# Altium schematic sheet Measuring.SchDoc: Voltage Measurer
size 420 x 297 mm; ENG_APP_DATE: --/--/--; DSN_APP_DATE: --/--/--; CHK_APP_DATE: --/--/--; Revision: Cell Balancing
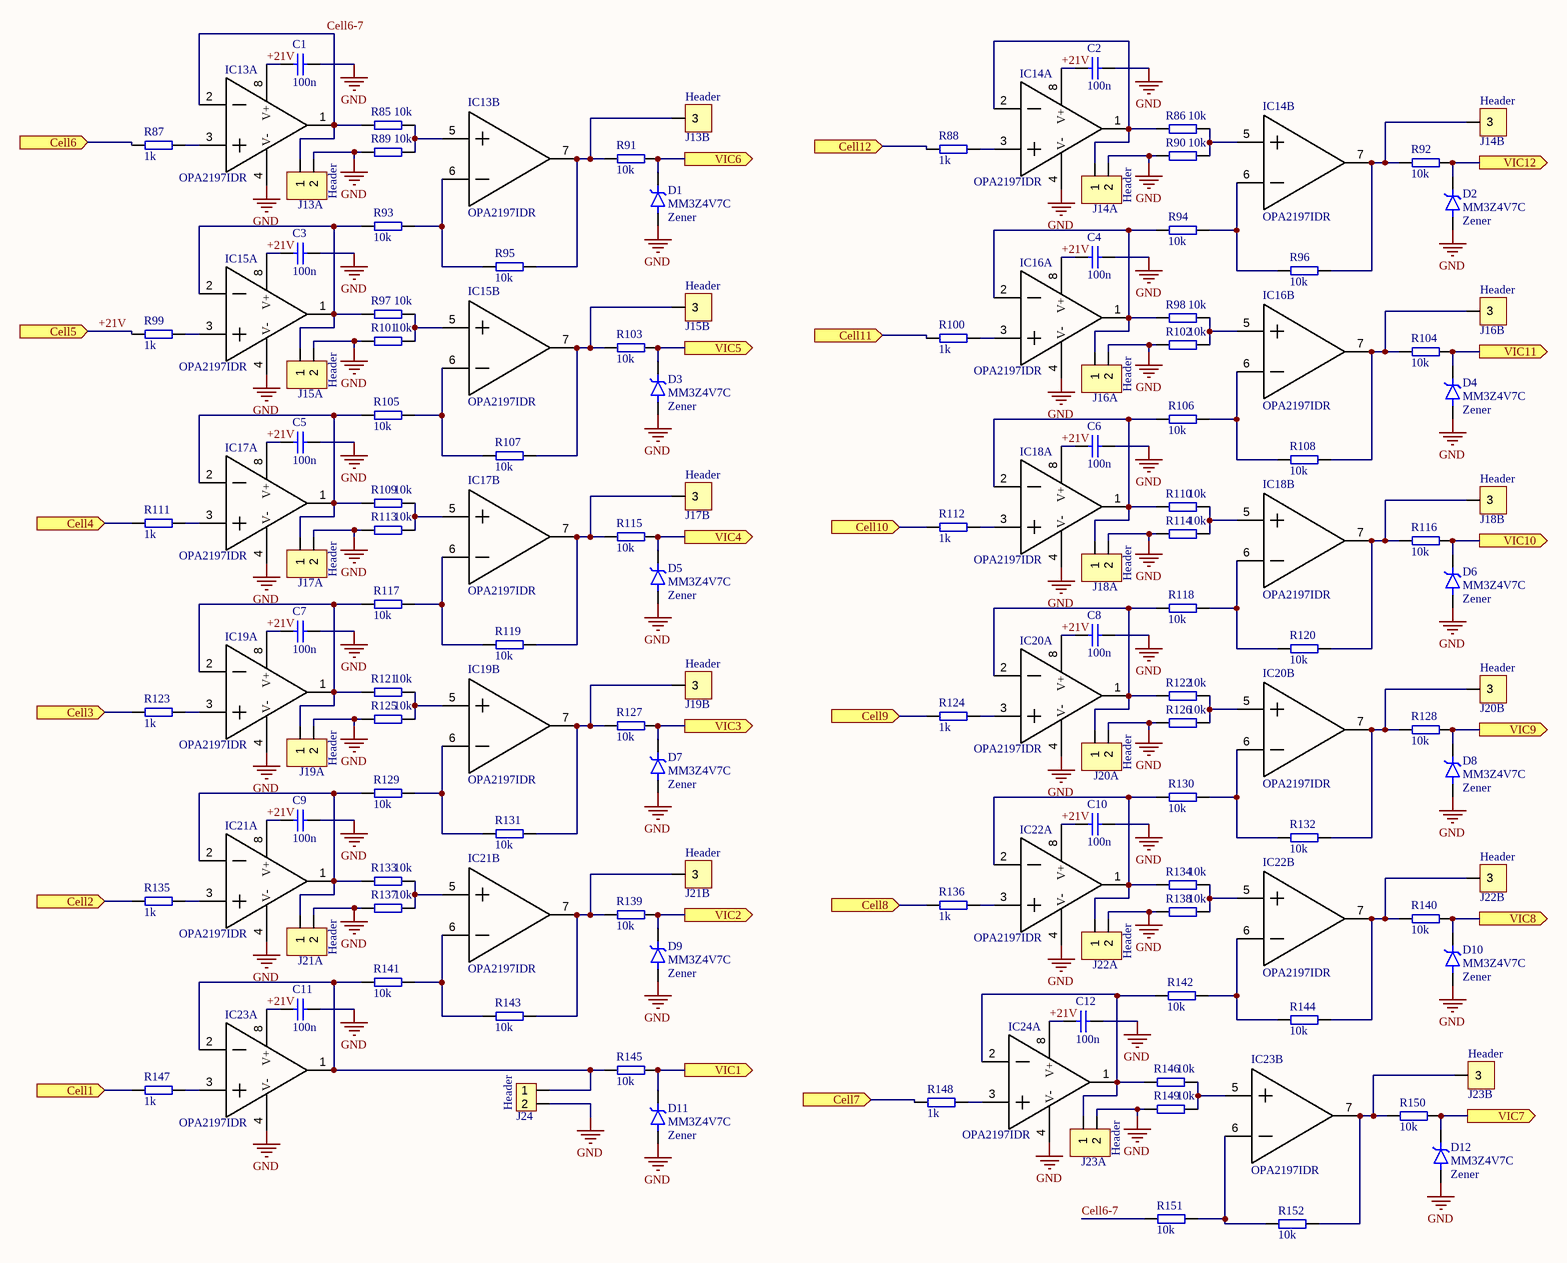
[diagram p0: Measuring.SchDoc]

## Parts
C1  Name: 100n  [C_0805]  (hidden comment: 100nF_35V)
C2  Name: 100n  [C_0805]  (hidden comment: 100nF_35V)
C3  Name: 100n  [C_0805]  (hidden comment: 100nF_35V)
C4  Name: 100n  [C_0805]  (hidden comment: 100nF_35V)
C5  Name: 100n  [C_0805]  (hidden comment: 100nF_35V)
C6  Name: 100n  [C_0805]  (hidden comment: 100nF_35V)
C7  Name: 100n  [C_0805]  (hidden comment: 100nF_35V)
C8  Name: 100n  [C_0805]  (hidden comment: 100nF_35V)
C9  Name: 100n  [C_0805]  (hidden comment: 100nF_35V)
C10  Name: 100n  [C_0805]  (hidden comment: 100nF_35V)
C11  Name: 100n  [C_0805]  (hidden comment: 100nF_35V)
C12  Name: 100n  [C_0805]  (hidden comment: 100nF_35V)
D1  value MM3Z4V7C  Type: Zener  [SODFL2512X90N]  (hidden comment: MM3Z4V7C_SOD-323F)
D2  value MM3Z4V7C  Type: Zener  [SODFL2512X90N]  (hidden comment: MM3Z4V7C_SOD-323F)
D3  value MM3Z4V7C  Type: Zener  [SODFL2512X90N]  (hidden comment: MM3Z4V7C_SOD-323F)
D4  value MM3Z4V7C  Type: Zener  [SODFL2512X90N]  (hidden comment: MM3Z4V7C_SOD-323F)
D5  value MM3Z4V7C  Type: Zener  [SODFL2512X90N]  (hidden comment: MM3Z4V7C_SOD-323F)
D6  value MM3Z4V7C  Type: Zener  [SODFL2512X90N]  (hidden comment: MM3Z4V7C_SOD-323F)
D7  value MM3Z4V7C  Type: Zener  [SODFL2512X90N]  (hidden comment: MM3Z4V7C_SOD-323F)
D8  value MM3Z4V7C  Type: Zener  [SODFL2512X90N]  (hidden comment: MM3Z4V7C_SOD-323F)
D9  value MM3Z4V7C  Type: Zener  [SODFL2512X90N]  (hidden comment: MM3Z4V7C_SOD-323F)
D10  value MM3Z4V7C  Type: Zener  [SODFL2512X90N]  (hidden comment: MM3Z4V7C_SOD-323F)
D11  value MM3Z4V7C  Type: Zener  [SODFL2512X90N]  (hidden comment: MM3Z4V7C_SOD-323F)
D12  value MM3Z4V7C  Type: Zener  [SODFL2512X90N]  (hidden comment: MM3Z4V7C_SOD-323F)
IC13  Manufacturer_Part_Number: OPA2197IDR  [SOIC8]  (hidden comment: OPA2197IDR_8-SOIC)  (parts A,B of 2)
IC14  Manufacturer_Part_Number: OPA2197IDR  [SOIC8]  (hidden comment: OPA2197IDR_8-SOIC)  (parts A,B of 2)
IC15  Manufacturer_Part_Number: OPA2197IDR  [SOIC8]  (hidden comment: OPA2197IDR_8-SOIC)  (parts A,B of 2)
IC16  Manufacturer_Part_Number: OPA2197IDR  [SOIC8]  (hidden comment: OPA2197IDR_8-SOIC)  (parts A,B of 2)
IC17  Manufacturer_Part_Number: OPA2197IDR  [SOIC8]  (hidden comment: OPA2197IDR_8-SOIC)  (parts A,B of 2)
IC18  Manufacturer_Part_Number: OPA2197IDR  [SOIC8]  (hidden comment: OPA2197IDR_8-SOIC)  (parts A,B of 2)
IC19  Manufacturer_Part_Number: OPA2197IDR  [SOIC8]  (hidden comment: OPA2197IDR_8-SOIC)  (parts A,B of 2)
IC20  Manufacturer_Part_Number: OPA2197IDR  [SOIC8]  (hidden comment: OPA2197IDR_8-SOIC)  (parts A,B of 2)
IC21  Manufacturer_Part_Number: OPA2197IDR  [SOIC8]  (hidden comment: OPA2197IDR_8-SOIC)  (parts A,B of 2)
IC22  Manufacturer_Part_Number: OPA2197IDR  [SOIC8]  (hidden comment: OPA2197IDR_8-SOIC)  (parts A,B of 2)
IC23  Manufacturer_Part_Number: OPA2197IDR  [SOIC8]  (hidden comment: OPA2197IDR_8-SOIC)  (parts A,B of 2)
IC24  Manufacturer_Part_Number: OPA2197IDR  [SOIC8]  (hidden comment: OPA2197IDR_8-SOIC)  (part A of 2)
J13  Name: Header  [HDR_1X3_2.54mm-MALE]  (hidden comment: 2.54mm pitch)  (parts A,B of 2)
J14  Name: Header  [HDR_1X3_2.54mm-MALE]  (hidden comment: 2.54mm pitch)  (parts A,B of 2)
J15  Name: Header  [HDR_1X3_2.54mm-MALE]  (hidden comment: 2.54mm pitch)  (parts A,B of 2)
J16  Name: Header  [HDR_1X3_2.54mm-MALE]  (hidden comment: 2.54mm pitch)  (parts A,B of 2)
J17  Name: Header  [HDR_1X3_2.54mm-MALE]  (hidden comment: 2.54mm pitch)  (parts A,B of 2)
J18  Name: Header  [HDR_1X3_2.54mm-MALE]  (hidden comment: 2.54mm pitch)  (parts A,B of 2)
J19  Name: Header  [HDR_1X3_2.54mm-MALE]  (hidden comment: 2.54mm pitch)  (parts A,B of 2)
J20  Name: Header  [HDR_1X3_2.54mm-MALE]  (hidden comment: 2.54mm pitch)  (parts A,B of 2)
J21  Name: Header  [HDR_1X3_2.54mm-MALE]  (hidden comment: 2.54mm pitch)  (parts A,B of 2)
J22  Name: Header  [HDR_1X3_2.54mm-MALE]  (hidden comment: 2.54mm pitch)  (parts A,B of 2)
J23  Name: Header  [HDR_1X3_2.54mm-MALE]  (hidden comment: 2.54mm pitch)  (parts A,B of 2)
J24  Name: Header  [HDR_1x2_2.54mm-MALE]  (hidden comment: 2.54mm pitch)
R85  Name: 10k  [R_0805]  (hidden comment: 10k_125mW)
R86  Name: 10k  [R_0805]  (hidden comment: 10k_125mW)
R87  Name: 1k  [R_0805]  (hidden comment: 1k_125mW)
R88  Name: 1k  [R_0805]  (hidden comment: 1k_125mW)
R89  Name: 10k  [R_0805]  (hidden comment: 10k_125mW)
R90  Name: 10k  [R_0805]  (hidden comment: 10k_125mW)
R91  Name: 10k  [R_0805]  (hidden comment: 10k_125mW)
R92  Name: 10k  [R_0805]  (hidden comment: 10k_125mW)
R93  Name: 10k  [R_0805]  (hidden comment: 10k_125mW)
R94  Name: 10k  [R_0805]  (hidden comment: 10k_125mW)
R95  Name: 10k  [R_0805]  (hidden comment: 10k_125mW)
R96  Name: 10k  [R_0805]  (hidden comment: 10k_125mW)
R97  Name: 10k  [R_0805]  (hidden comment: 10k_125mW)
R98  Name: 10k  [R_0805]  (hidden comment: 10k_125mW)
R99  Name: 1k  [R_0805]  (hidden comment: 1k_125mW)
R100  Name: 1k  [R_0805]  (hidden comment: 1k_125mW)
R101  Name: 10k  [R_0805]  (hidden comment: 10k_125mW)
R102  Name: 10k  [R_0805]  (hidden comment: 10k_125mW)
R103  Name: 10k  [R_0805]  (hidden comment: 10k_125mW)
R104  Name: 10k  [R_0805]  (hidden comment: 10k_125mW)
R105  Name: 10k  [R_0805]  (hidden comment: 10k_125mW)
R106  Name: 10k  [R_0805]  (hidden comment: 10k_125mW)
R107  Name: 10k  [R_0805]  (hidden comment: 10k_125mW)
R108  Name: 10k  [R_0805]  (hidden comment: 10k_125mW)
R109  Name: 10k  [R_0805]  (hidden comment: 10k_125mW)
R110  Name: 10k  [R_0805]  (hidden comment: 10k_125mW)
R111  Name: 1k  [R_0805]  (hidden comment: 1k_125mW)
R112  Name: 1k  [R_0805]  (hidden comment: 1k_125mW)
R113  Name: 10k  [R_0805]  (hidden comment: 10k_125mW)
R114  Name: 10k  [R_0805]  (hidden comment: 10k_125mW)
R115  Name: 10k  [R_0805]  (hidden comment: 10k_125mW)
R116  Name: 10k  [R_0805]  (hidden comment: 10k_125mW)
R117  Name: 10k  [R_0805]  (hidden comment: 10k_125mW)
R118  Name: 10k  [R_0805]  (hidden comment: 10k_125mW)
R119  Name: 10k  [R_0805]  (hidden comment: 10k_125mW)
R120  Name: 10k  [R_0805]  (hidden comment: 10k_125mW)
R121  Name: 10k  [R_0805]  (hidden comment: 10k_125mW)
R122  Name: 10k  [R_0805]  (hidden comment: 10k_125mW)
R123  Name: 1k  [R_0805]  (hidden comment: 1k_125mW)
R124  Name: 1k  [R_0805]  (hidden comment: 1k_125mW)
R125  Name: 10k  [R_0805]  (hidden comment: 10k_125mW)
R126  Name: 10k  [R_0805]  (hidden comment: 10k_125mW)
R127  Name: 10k  [R_0805]  (hidden comment: 10k_125mW)
R128  Name: 10k  [R_0805]  (hidden comment: 10k_125mW)
R129  Name: 10k  [R_0805]  (hidden comment: 10k_125mW)
R130  Name: 10k  [R_0805]  (hidden comment: 10k_125mW)
R131  Name: 10k  [R_0805]  (hidden comment: 10k_125mW)
R132  Name: 10k  [R_0805]  (hidden comment: 10k_125mW)
R133  Name: 10k  [R_0805]  (hidden comment: 10k_125mW)
R134  Name: 10k  [R_0805]  (hidden comment: 10k_125mW)
R135  Name: 1k  [R_0805]  (hidden comment: 1k_125mW)
R136  Name: 1k  [R_0805]  (hidden comment: 1k_125mW)
R137  Name: 10k  [R_0805]  (hidden comment: 10k_125mW)
R138  Name: 10k  [R_0805]  (hidden comment: 10k_125mW)
R139  Name: 10k  [R_0805]  (hidden comment: 10k_125mW)
R140  Name: 10k  [R_0805]  (hidden comment: 10k_125mW)
R141  Name: 10k  [R_0805]  (hidden comment: 10k_125mW)
R142  Name: 10k  [R_0805]  (hidden comment: 10k_125mW)
R143  Name: 10k  [R_0805]  (hidden comment: 10k_125mW)
R144  Name: 10k  [R_0805]  (hidden comment: 10k_125mW)
R145  Name: 10k  [R_0805]  (hidden comment: 10k_125mW)
R146  Name: 10k  [R_0805]  (hidden comment: 10k_125mW)
R147  Name: 1k  [R_0805]  (hidden comment: 1k_125mW)
R148  Name: 1k  [R_0805]  (hidden comment: 1k_125mW)
R149  Name: 10k  [R_0805]  (hidden comment: 10k_125mW)
R150  Name: 10k  [R_0805]  (hidden comment: 10k_125mW)
R151  Name: 10k  [R_0805]  (hidden comment: 10k_125mW)
R152  Name: 10k  [R_0805]  (hidden comment: 10k_125mW)

## Ports
Cell1 (in), Cell2 (in), Cell3 (in), Cell4 (in), Cell5 (in), Cell6 (in), Cell7 (in), Cell8 (in), Cell9 (in), Cell10 (in), Cell11 (in), Cell12 (in), VIC1 (out), VIC2 (out), VIC3 (out), VIC4 (out), VIC5 (out), VIC6 (out), VIC7 (out), VIC8 (out), VIC9 (out), VIC10 (out), VIC11 (out), VIC12 (out)

## Nets
GND: C1.1 C2.1 C3.1 C4.1 C5.1 C6.1 C7.1 C8.1 C9.1 C10.1 C11.1 C12.1 D1.A D2.A D3.A D4.A D5.A D6.A D7.A D8.A D9.A D10.A D11.A D12.A IC13.4(V-) IC14.4(V-) IC15.4(V-) IC16.4(V-) IC17.4(V-) IC18.4(V-) IC19.4(V-) IC20.4(V-) IC21.4(V-) IC22.4(V-) IC23.4(V-) IC24.4(V-) J13.2 J14.2 J15.2 J16.2 J17.2 J18.2 J19.2 J20.2 J21.2 J22.2 J23.2 J24.2 R89.2 R90.2 R101.2 R102.2 R113.2 R114.2 R125.2 R126.2 R137.2 R138.2 R149.2
+21V: C1.2 C2.2 C3.2 C4.2 C5.2 C6.2 C7.2 C8.2 C9.2 C10.2 C11.2 C12.2 IC13.8(V+) IC14.8(V+) IC15.8(V+) IC16.8(V+) IC17.8(V+) IC18.8(V+) IC19.8(V+) IC20.8(V+) IC21.8(V+) IC22.8(V+) IC23.8(V+) IC24.8(V+) R99.2 ; port Cell5
Cell1: R147.2 ; port Cell1
Cell2: R135.2 ; port Cell2
Cell3: R123.2 ; port Cell3
Cell4: R111.2 ; port Cell4
Cell6: R87.2 ; port Cell6
Cell6-7: IC13.1(OUT_A) IC13.2(-IN_A) J13.1 R85.2 R151.2
Cell7: R148.2 ; port Cell7
Cell8: R136.2 ; port Cell8
Cell9: R124.2 ; port Cell9
Cell10: R112.2 ; port Cell10
Cell11: R100.2 ; port Cell11
Cell12: R88.2 ; port Cell12
VIC1: D11.K R145.1 ; port VIC1
VIC2: D9.K R139.1 ; port VIC2
VIC3: D7.K R127.1 ; port VIC3
VIC4: D5.K R115.1 ; port VIC4
VIC5: D3.K R103.1 ; port VIC5
VIC6: D1.K R91.1 ; port VIC6
VIC7: D12.K R150.1 ; port VIC7
VIC8: D10.K R140.1 ; port VIC8
VIC9: D8.K R128.1 ; port VIC9
VIC10: D6.K R116.1 ; port VIC10
VIC11: D4.K R104.1 ; port VIC11
VIC12: D2.K R92.1 ; port VIC12
NetIC13_3: IC13.3(+IN_A) R87.1
NetIC13_5: IC13.5(+IN_B) R85.1 R89.1
NetIC13_6: IC13.6(-IN_B) R93.1 R95.2
NetIC13_7: IC13.7(OUT_B) J13.3 R91.2 R95.1
NetIC14_1: IC14.1(OUT_A) IC14.2(-IN_A) J14.1 R86.2
NetIC14_3: IC14.3(+IN_A) R88.1
NetIC14_5: IC14.5(+IN_B) R86.1 R90.1
NetIC14_6: IC14.6(-IN_B) R94.1 R96.2
NetIC14_7: IC14.7(OUT_B) J14.3 R92.2 R96.1
NetIC15_1: IC15.1(OUT_A) IC15.2(-IN_A) J15.1 R93.2 R97.2
NetIC15_3: IC15.3(+IN_A) R99.1
NetIC15_5: IC15.5(+IN_B) R97.1 R101.1
NetIC15_6: IC15.6(-IN_B) R105.1 R107.2
NetIC15_7: IC15.7(OUT_B) J15.3 R103.2 R107.1
NetIC16_1: IC16.1(OUT_A) IC16.2(-IN_A) J16.1 R94.2 R98.2
NetIC16_3: IC16.3(+IN_A) R100.1
NetIC16_5: IC16.5(+IN_B) R98.1 R102.1
NetIC16_6: IC16.6(-IN_B) R106.1 R108.2
NetIC16_7: IC16.7(OUT_B) J16.3 R104.2 R108.1
NetIC17_1: IC17.1(OUT_A) IC17.2(-IN_A) J17.1 R105.2 R109.2
NetIC17_3: IC17.3(+IN_A) R111.1
NetIC17_5: IC17.5(+IN_B) R109.1 R113.1
NetIC17_6: IC17.6(-IN_B) R117.1 R119.2
NetIC17_7: IC17.7(OUT_B) J17.3 R115.2 R119.1
NetIC18_1: IC18.1(OUT_A) IC18.2(-IN_A) J18.1 R106.2 R110.2
NetIC18_3: IC18.3(+IN_A) R112.1
NetIC18_5: IC18.5(+IN_B) R110.1 R114.1
NetIC18_6: IC18.6(-IN_B) R118.1 R120.2
NetIC18_7: IC18.7(OUT_B) J18.3 R116.2 R120.1
NetIC19_1: IC19.1(OUT_A) IC19.2(-IN_A) J19.1 R117.2 R121.2
NetIC19_3: IC19.3(+IN_A) R123.1
NetIC19_5: IC19.5(+IN_B) R121.1 R125.1
NetIC19_6: IC19.6(-IN_B) R129.1 R131.2
NetIC19_7: IC19.7(OUT_B) J19.3 R127.2 R131.1
NetIC20_1: IC20.1(OUT_A) IC20.2(-IN_A) J20.1 R118.2 R122.2
NetIC20_3: IC20.3(+IN_A) R124.1
NetIC20_5: IC20.5(+IN_B) R122.1 R126.1
NetIC20_6: IC20.6(-IN_B) R130.1 R132.2
NetIC20_7: IC20.7(OUT_B) J20.3 R128.2 R132.1
NetIC21_1: IC21.1(OUT_A) IC21.2(-IN_A) J21.1 R129.2 R133.2
NetIC21_3: IC21.3(+IN_A) R135.1
NetIC21_5: IC21.5(+IN_B) R133.1 R137.1
NetIC21_6: IC21.6(-IN_B) R141.1 R143.2
NetIC21_7: IC21.7(OUT_B) J21.3 R139.2 R143.1
NetIC22_1: IC22.1(OUT_A) IC22.2(-IN_A) J22.1 R130.2 R134.2
NetIC22_3: IC22.3(+IN_A) R136.1
NetIC22_5: IC22.5(+IN_B) R134.1 R138.1
NetIC22_6: IC22.6(-IN_B) R142.1 R144.2
NetIC22_7: IC22.7(OUT_B) J22.3 R140.2 R144.1
NetIC23_1: IC23.1(OUT_A) IC23.2(-IN_A) J24.1 R141.2 R145.2
NetIC23_3: IC23.3(+IN_A) R147.1
NetIC23_5: IC23.5(+IN_B) R146.1 R149.1
NetIC23_6: IC23.6(-IN_B) R151.1 R152.2
NetIC23_7: IC23.7(OUT_B) J23.3 R150.2 R152.1
NetIC24_1: IC24.1(OUT_A) IC24.2(-IN_A) J23.1 R142.2 R146.2
NetIC24_3: IC24.3(+IN_A) R148.1

## Notes on the sheet
- THIS DOCUMENT AND THE DATA DISCLOSED HEREIN OR
- HEREWITH IS THE PROPERTY OF ALTIUM LIMITED AND MAY
- DWG NO:
- REVISION
- REV:
- DESCRIPTION
- DATE
- APPROVED
- BE FREELY DISTRIBUTED IN WHOLE. NO RIGHTS ARE
- RESERVED OR EXPRESS OR IMPLIED WARANTEE GIVEN.
- ENG:
- APPROVALS
- PROJECT
- DSN:
- CHK:
- REFERENCE DOCUMENTS
- PROJECT REVISION:
- TITLE
- DOCUMENT REVISION:
- DESIGN ITEM:
- BOM:
- FAB DWG:
- PCB DWG:
- ASSY DWG:
- SCALE:
- A3
- SIZE
- CAGE CODE
- FILE NAME
- DWG NO.
- SHEET
- OF
- REV

## Library data of the parts
C1-C12 = C_100nF_0805: Capacitor [SMD]; Manufacturer: Murata; Manufacturer Part Number: GCJ21BL81H104KA01L; Capacitance: 100nF; Tolerance: 10%; Voltage Rating: 50V; ComponentLink1Description: DATASHEET; ComponentLink1URL: https://hr.mouser.com/datasheet/2/281/GCJ21BL81H104KA01_01-1963909.pdf; ComponentLink2Description: BUY; ComponentLink2URL: https://hr.mouser.com/ProductDetail/Murata-Electronics/GCJ21BL81H104KA01L?qs=QzBtWTOodeX5ICEuC%252Bh33g%3D%3D; Supplier 1: Mouser; Supplier Part Number 1: 81-GCJ21BL81H104KA1L; Case Code (Imperial): 0805; Case Code (Metric): 2012; Case/Package: 0805; Features: Soft Termination; Max Operating Temperature: 150°C; Min Operating Temperature: -55°C; Mount: Surface Mount; Packaging: Tape and Reel; Ratings: AEC-Q200; RoHS Compliant: Yes; Supplier Packaging 1: Tape & Reel; Supplier Unit Price 1: $0.30; Supplier Location 1: US
D1-D12 = MM3Z4V7C_SOD-323F: Zener Single Diode, 4.7 V, 200 mW [SMD]; Manufacturer: ON Semiconductor / Fairchild; MP: 1N4148WS; MF: ON Semiconductor; Forward Voltage: 1V; Impedance: 75R; Max Power Dissipation: 200mW; Max Reverse Current: 2.7uA; Test Current: 5mA; Tolerance: 5%; Working Voltage: 4.7V; Price: None; SnapEDA_Link: https://www.snapeda.com/parts/1N4148WS/ON%20Semiconductor/view-part/2747266/?ref=snap; Availability: Good; Package: SOD-323FL-2 ON Semiconductor; ComponentLink1Description: DATASHEET; ComponentLink1URL: https://hr.mouser.com/datasheet/2/308/1/MM3Z9V1C_D-2315854.pdf; ComponentLink2Description: BUY; ComponentLink2URL: https://hr.mouser.com/ProductDetail/onsemi-Fairchild/MM3Z4V7C?qs=sGAEpiMZZMtdo5lL%2F%252BX2BwKAOpX0rFyD; Check_prices: https://www.snapeda.com/parts/1N4148WS/ON%20Semiconductor/view-part/2747266/?ref=eda; Purchase-URL: https://pricing.snapeda.com/search/part/1N4148WS/?ref=eda; Supplier 1: Mouser; Supplier Part Number 1: 512-MM3Z4V7C; Element Configuration: Single; Height: 1mm; Lead Free: Lead Free; Length: 1.3mm; Max Operating Temperature: 150°C; Max Reverse Leakage Current: 2.7uA; Min Operating Temperature: -65°C; Mount: Surface Mount; Number of Pins: 2; Package Quantity: 1; Packaging: Tape and Reel; Power Dissipation: 200mW; Radiation Hardening: No; RoHS Compliant: Yes; Voltage Tolerance: 5%; Weight: 0.0276g; Width: 1.7mm; Zener Voltage: 4.7V; Supplier Packaging 1: Tape & Reel; Supplier Unit Price 1: $0.24; Supplier Location 1: US; Manufacturer Part Number: MM3Z4V7C; Case/Package: SOD−323FL
IC13-IC24 = OPA2197IDR_8-SOIC: Dual OP AMP [TH]; Manufacturer_Name: Texas Instruments; Bandwidth: 10MHz; Input Bias Current: 5pA; Input Offset Voltage (Vos): 250uV; Number of Amplifiers: 2; Operating Supply Current: 1mA; Output Current per Channel: 65mA; Slew Rate: 20V/µs; Datasheet Link: https://componentsearchengine.com/Datasheets/2/OPA2197IDR.pdf; Height: 1.75mm; Mouser Part Number: 595-OPA2197IDR; Mouser Price/Stock: https://www.mouser.com/Search/Refine.aspx?Keyword=595-OPA2197IDR; ComponentLink1Description: DATASHEET; ComponentLink1URL: https://www.ti.com/lit/ds/symlink/opa2197.pdf?HQS=dis-mous-null-mousermode-dsf-pf-null-wwe&ts=1646121857740&ref_url=https%253A%252F%252Fwww.mouser.de%252F; ComponentLink2Description: BUY; ComponentLink2URL: https://hr.mouser.com/ProductDetail/Texas-Instruments/OPA2197IDR?qs=LuYMPh7GGMTV7Fo%252BZRgbTw%3D%3D; Supplier 1: Mouser; Supplier Part Number 1: 595-OPA2197IDR; Case/Package: SOIC-8; Gain Bandwidth Product: 10MHz; Lead Free: Lead Free; Max Operating Temperature: 125°C; Min Operating Temperature: -40°C; Mount: Surface Mount; Number of Channels: 2; Number of Circuits: 2; Number of Pins: 8; Packaging: Cut Tape; REACH SVHC: No SVHC; RoHS Compliant: Yes; Supplier Packaging 1: Tape & Reel; Supplier Unit Price 1: $2.72; Supplier Location 1: US; Manufacturer: Texas Instruments; Manufacturer Part Number: OPA2197IDR
J13-J23 = Header 1x3AB: Header, 3-Pin [TH]; Manufacturer: Molex; Connector Type: Male Pin; Current Rating: 4A; Gender: Male; Glow Wire Compliant: Non-compliant; Number of Circuits: 15; Pitch: 0.1inch; Voltage Rating: 250V; LatestRevisionDate: 17-Jul-2002; LatestRevisionNote: Re-released for DXP Platform.; Publisher: Altium Limited; ComponentLink1Description: DATASHEET; ComponentLink1URL: https://hr.mouser.com/datasheet/2/276/0022284150_PCB_HEADERS-159054.pdf; ComponentLink2Description: BUY; ComponentLink2URL: https://hr.mouser.com/ProductDetail/Molex/22-28-4150?qs=M5Ic86%252BuP8aClMFgmZrq7g%3D%3D; Supplier 1: Mouser; Supplier Part Number 1: 538-22-28-4150; Color: Black; Contact Material: Brass; Contact Mating Length: 0.24inch; Contact Plating: Tin; Contact Type: Male Pin; Flammability Rating: UL94 V-0; Height: 2.29mm; Housing Color: Black; Housing Material: Thermoplastic; Lead Free: Contains Lead; Length: 38.1mm; Mount: Through Hole; Number of Contacts: 15; Number of Positions: 15; Number of Rows: 1; Orientation: Vertical; Package Quantity: 1; Packaging: Bulk; RoHS Compliant: Yes; Series: KK® 42375; Termination: Solder; Voltage Rating (DC): 250V; Width: 2.49mm; Supplier Packaging 1: Bulk; Supplier Unit Price 1: $0.57; Supplier Location 1: US; Manufacturer Part Number: 22-28-4150
J24 = Header 1x2: Header, 2-Pin [TH]; Manufacturer: Molex; Current Rating: 4A; Gender: Male; Glow Wire Compliant: Non-compliant; Number of Circuits: 15; Pitch: 0.1inch; Voltage Rating: 250V; Connector Type: Male Pin; LatestRevisionDate: 17-Jul-2002; LatestRevisionNote: Re-released for DXP Platform.; Publisher: Altium Limited; ComponentLink1Description: DATASHEET; ComponentLink1URL: https://hr.mouser.com/datasheet/2/276/0022284150_PCB_HEADERS-159054.pdf; ComponentLink2Description: BUY; ComponentLink2URL: https://hr.mouser.com/ProductDetail/Molex/22-28-4150?qs=M5Ic86%252BuP8aClMFgmZrq7g%3D%3D; Supplier 1: Mouser; Supplier Part Number 1: 538-22-28-4150; Color: Black; Contact Material: Brass; Contact Mating Length: 0.24inch; Contact Plating: Tin; Contact Type: Male Pin; Flammability Rating: UL94 V-0; Height: 2.29mm; Housing Color: Black; Housing Material: Thermoplastic; Lead Free: Contains Lead; Length: 38.1mm; Mount: Through Hole; Number of Contacts: 15; Number of Positions: 15; Number of Rows: 1; Orientation: Vertical; Package Quantity: 1; Packaging: Bulk; RoHS Compliant: Yes; Series: KK® 42375; Termination: Solder; Voltage Rating (DC): 250V; Width: 2.49mm; Supplier Packaging 1: Bulk; Supplier Unit Price 1: $0.57; Supplier Location 1: US; Manufacturer Part Number: 22-28-4150
R85 R86 R89-R98 R101-R110 R113-R122 R125-R134 R137-R146 R149-R152 = R_10k_0805: Resistor [SMD]; Manufacturer: Vishay; Manufacturer Part Number: CRCW080510K0FKEAC; Power Rating: 125mW; Resistance: 10000R; Tolerance: 1%; ComponentLink1Description: DATASHEET; ComponentLink1URL: https://hr.mouser.com/datasheet/2/427/crcwce3-1762584.pdf; ComponentLink2Description: BUY; ComponentLink2URL: https://hr.mouser.com/ProductDetail/Vishay-Dale/CRCW080510K0FKEAC?qs=E3Y5ESvWgWORadmUijPtxQ%3D%3D; Supplier 1: Mouser; Supplier Part Number 1: 71-CRCW080510K0FKEAC; Case/Package: 0805; Lead Free: Lead Free; RoHS Compliant: Yes; Supplier Packaging 1: Tape & Reel; Supplier Unit Price 1: $0.10; Supplier Location 1: US
R87 R88 R99 R100 R111 R112 R123 R124 R135 R136 R147 R148 = R_1k_0805: Resistor [SMD]; Manufacturer: Vishay; Manufacturer Part Number: CRCW08051K00FKEAC; Max Power Dissipation: 125mW; Resistance: 1kR; Temperature Coefficient: 100ppm/°C; Tolerance: 1%; Voltage Rating: 150V; ComponentLink1Description: DATASHEET; ComponentLink1URL: https://www.mouser.com/datasheet/2/427/crcwce3-1762584.pdf; ComponentLink2Description: BUY; ComponentLink2URL: https://www.mouser.com/ProductDetail/Vishay-Dale/CRCW08051K00FKEAC?qs=CZ6xfwOSLTXmQIgaYvN%2FBA%3D%3D; Supplier 1: Mouser; Supplier Part Number 1: 71-CRCW08051K00FKEAC; Case Code (Imperial): 0805; Case Code (Metric): 2012; Case/Package: 0805; Contact Plating: Tin; Features: Automotive AEC-Q200,Anti-Sulfur; Height: 0.02inch; Length: 2mm; Max Operating Temperature: 155°C; Min Operating Temperature: -55°C; Number of Terminations: 2; Package Quantity: 5000; Packaging: Tape and Reel; Power Rating: 125mW; Radiation Hardening: No; Resistor Type: Thick Film; RoHS Compliant: Yes; Series: RCA; Termination: Wraparound; Width: 0.049inch; Supplier Packaging 1: Tape & Reel; Supplier Unit Price 1: $0.12; Supplier Location 1: US; Lead Free: Lead Free; Mount: Surface Mount